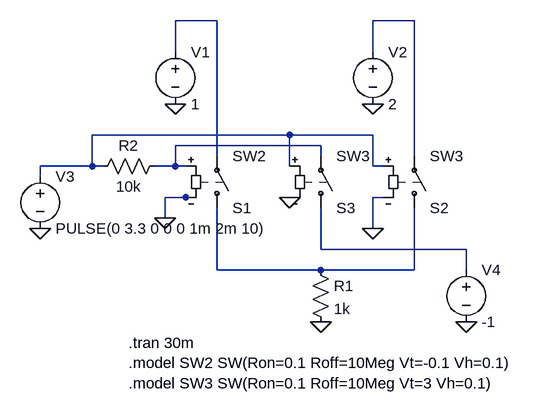
[diagram p0: schematic analog muxdemux.asc]
analog muxdemux.asc, the LTspice schematic file:
Version 4
SHEET 1 880 680
WIRE 224 -80 160 -80
WIRE 528 -80 464 -80
WIRE 160 -32 160 -80
WIRE 464 -32 464 -80
WIRE 336 96 32 96
WIRE 464 96 336 96
WIRE 384 112 160 112
WIRE 224 128 224 -80
WIRE 384 128 384 112
WIRE 528 128 528 -80
WIRE 32 144 32 96
WIRE 32 144 -48 144
WIRE 48 144 32 144
WIRE 160 144 160 112
WIRE 160 144 128 144
WIRE 176 144 160 144
WIRE 336 144 336 96
WIRE 464 144 464 96
WIRE 480 144 464 144
WIRE -48 160 -48 144
WIRE 176 192 144 192
WIRE 192 192 176 192
WIRE 480 192 464 192
WIRE 144 224 144 192
WIRE 464 240 464 192
WIRE 384 272 384 208
WIRE 608 272 384 272
WIRE 224 304 224 208
WIRE 384 304 224 304
WIRE 528 304 528 208
WIRE 528 304 384 304
WIRE 608 304 608 272
FLAG 144 224 0
FLAG 464 240 0
FLAG 384 384 0
FLAG 160 48 0
FLAG 464 48 0
FLAG -48 240 0
FLAG 336 192 0
FLAG 608 384 0
SYMBOL sw 224 224 M180
SYMATTR InstName S1
SYMATTR Value SW2
SYMBOL sw 528 224 M180
SYMATTR InstName S2
SYMATTR Value SW3
SYMBOL res 368 288 R0
SYMATTR InstName R1
SYMATTR Value 1k
SYMBOL voltage 160 -48 R0
WINDOW 123 0 0 Left 0
WINDOW 39 0 0 Left 0
SYMATTR InstName V1
SYMATTR Value 1
SYMBOL voltage 464 -48 R0
WINDOW 123 0 0 Left 0
WINDOW 39 0 0 Left 0
SYMATTR InstName V2
SYMATTR Value 2
SYMBOL voltage -48 144 R0
WINDOW 123 0 0 Left 0
WINDOW 39 0 0 Left 0
SYMATTR InstName V3
SYMATTR Value PULSE(0 3.3 0 0 0 1m 2m 10)
SYMBOL res 144 128 R90
WINDOW 0 0 56 VBottom 2
WINDOW 3 32 56 VTop 2
SYMATTR InstName R2
SYMATTR Value 10k
SYMBOL sw 384 224 M180
SYMATTR InstName S3
SYMATTR Value SW3
SYMBOL voltage 608 288 R0
WINDOW 123 0 0 Left 0
WINDOW 39 0 0 Left 0
SYMATTR InstName V4
SYMATTR Value -1
TEXT 88 416 Left 2 !.tran 30m\n.model SW2 SW(Ron=0.1 Roff=10Meg Vt=-0.1 Vh=0.1)\n.model SW3 SW(Ron=0.1 Roff=10Meg Vt=3 Vh=0.1)

The netlist it stands for:
* analog muxdemux.asc
S1 N006 N001 N004 0 SW2
S2 N006 N002 N003 0 SW3
R1 N006 0 1k
V1 N001 0 1
V2 N002 0 2
V3 N003 0 PULSE(0 3.3 0 0 0 1m 2m 10)
R2 N004 N003 10k
S3 N005 N004 N003 0 SW3
V4 N005 0 -1
.tran 30m
.model SW2 SW(Ron=0.1 Roff=10Meg Vt=-0.1 Vh=0.1)
.model SW3 SW(Ron=0.1 Roff=10Meg Vt=3 Vh=0.1)
.backanno
.end